# EAGLE design Quarfinder (EAGLE 9.0.1)

## Sheet 1 of 2
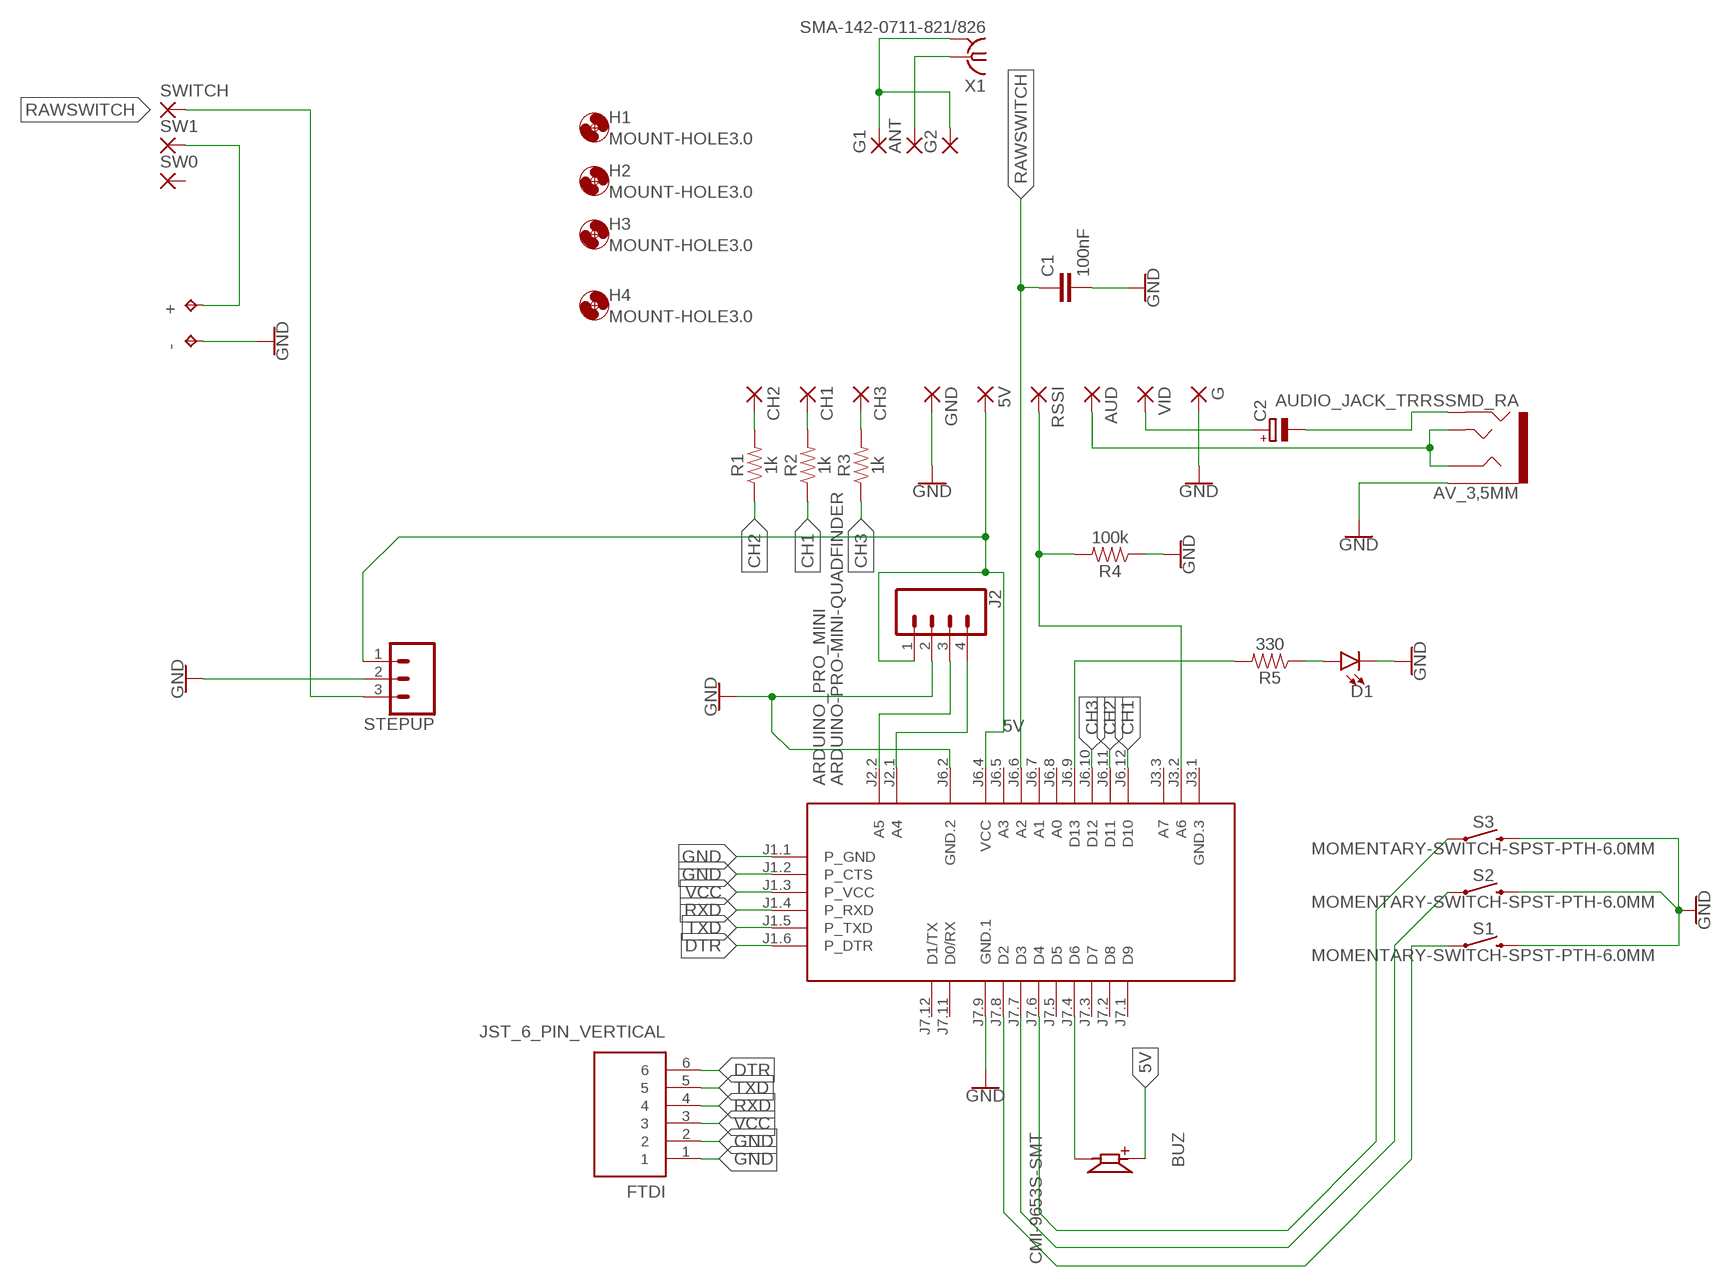
[diagram p0: schematic, sheet 1]

### Parts
5V  SMD2  [SMD1,27-2,54]
+  TPTP20R  [TP20R]
-  TPTP20R  [TP20R]
ANT  SMD2  [SMD1,27-2,54]
ARDUINO_PRO_MINI  ARDUINO-PRO-MINI-QUADFINDER  [ARDUINO-PRO-MINI]
AUD  SMD2  [SMD1,27-2,54]
AV_3,5MM  AUDIO_JACK_TRRSSMD_RA  [AUDIO_JACK_3.5MM_TRRS_SMD_RA]
BUZ  CMI-9653S-SMT  [CUI_CMI-9653S-SMT]
C1  100nF  1.0UF-0603-16V-10%  [0603]
C2  CPOL-EUD/7343-31R  [D/7343-31R]
CH1  SMD2  [SMD1,27-2,54]
CH2  SMD2  [SMD1,27-2,54]
CH3  SMD2  [SMD1,27-2,54]
D1  LED3MM  [LED_3MM]
FTDI  JST_6_PIN_VERTICAL  [JST-6-SMD-VERT-1.0MM]
G  SMD2  [SMD1,27-2,54]
G1  SMD2  [SMD1,27-2,54]
G2  SMD2  [SMD1,27-2,54]
GND  SMD2  [SMD1,27-2,54]
H1  MOUNT-HOLE3.0  [3,0]
H2  MOUNT-HOLE3.0  [3,0]
H3  MOUNT-HOLE3.0  [3,0]
H4  MOUNT-HOLE3.0  [3,0]
J2  CONN_04  [1X04]
R1  1k  1KOHM-0603-1/10W-1%  [0603]
R2  1k  1KOHM-0603-1/10W-1%  [0603]
R3  1k  1KOHM-0603-1/10W-1%  [0603]
R4  100k  1KOHM-0603-1/10W-1%  [0603]
R5  330  1KOHM-0603-1/10W-1%  [0603]
RSSI  SMD2  [SMD1,27-2,54]
S1  MOMENTARY-SWITCH-SPST-PTH-6.0MM  [TACTILE_SWITCH_PTH_6.0MM]
S2  MOMENTARY-SWITCH-SPST-PTH-6.0MM  [TACTILE_SWITCH_PTH_6.0MM]
S3  MOMENTARY-SWITCH-SPST-PTH-6.0MM  [TACTILE_SWITCH_PTH_6.0MM]
STEPUP  CONN_03  [1X03]
SW0  SMD2  [SMD1,27-2,54]
SW1  SMD2  [SMD1,27-2,54]
SWITCH  SMD2  [SMD1,27-2,54]
VID  SMD2  [SMD1,27-2,54]
X1  SMA-142-0711-821/826  [J502-ND-142-0711-821/826]

### Nets
5V [power]: 5V.1(P) ARDUINO_PRO_MINI.J6.4(VCC) BUZ.P J2.1 STEPUP.1
CH1: ARDUINO_PRO_MINI.J6.12(D10) R2.1
CH2: ARDUINO_PRO_MINI.J6.11(D11) R1.1
CH3: ARDUINO_PRO_MINI.J6.10(D12) R3.1
DTR: ARDUINO_PRO_MINI.J1.6(P_DTR) FTDI.6
GND: -.TP ARDUINO_PRO_MINI.J1.1(P_GND) ARDUINO_PRO_MINI.J1.2(P_CTS) ARDUINO_PRO_MINI.J6.2(GND.2) ARDUINO_PRO_MINI.J7.9(GND.1) AV_3,5MM.EARTH C1.2 D1.K(C) FTDI.1 FTDI.2 G1.1(P) G2.1(P) G.1(P) GND.1(P) J2.2 R4.1 S1.3 S2.3 S3.3 STEPUP.2 X1.G@1 X1.G@2 X1.G@3 X1.G@4
N$1: ANT.1(P) X1.1
N$2: C2.+ VID.1(P)
N$3: CH2.1(P) R1.2
N$4: CH1.1(P) R2.2
N$5: CH3.1(P) R3.2
N$6: ARDUINO_PRO_MINI.J2.1(A4) J2.4
N$7: ARDUINO_PRO_MINI.J2.2(A5) J2.3
N$8: ARDUINO_PRO_MINI.J3.2(A6) R4.2 RSSI.1(P)
N$9: ARDUINO_PRO_MINI.J7.8(D2) S1.1
N$10: ARDUINO_PRO_MINI.J7.4(D6) BUZ.N
N$11: ARDUINO_PRO_MINI.J7.7(D3) S2.1
N$12: ARDUINO_PRO_MINI.J7.6(D4) S3.1
N$13: D1.A R5.1
N$14: ARDUINO_PRO_MINI.J6.9(D13) R5.2
N$16: AUD.1(P) AV_3,5MM.RING1 AV_3,5MM.TIP
N$18: AV_3,5MM.RING2 C2.-
RAWSWITCH [power]: ARDUINO_PRO_MINI.J6.6(A2) C1.1 STEPUP.3 SWITCH.1(P)
RXD: ARDUINO_PRO_MINI.J1.4(P_RXD) FTDI.4
TXD: ARDUINO_PRO_MINI.J1.5(P_TXD) FTDI.5
VCC: ARDUINO_PRO_MINI.J1.3(P_VCC) FTDI.3
VIN [power]: +.TP SW1.1(P)
Unconnected: ARDUINO_PRO_MINI.J3.1(GND.3) ARDUINO_PRO_MINI.J3.3(A7) ARDUINO_PRO_MINI.J6.5(A3) ARDUINO_PRO_MINI.J6.7(A1) ARDUINO_PRO_MINI.J6.8(A0) ARDUINO_PRO_MINI.J7.1(D9) ARDUINO_PRO_MINI.J7.2(D8) ARDUINO_PRO_MINI.J7.3(D7) ARDUINO_PRO_MINI.J7.5(D5) ARDUINO_PRO_MINI.J7.11(D0/RX) ARDUINO_PRO_MINI.J7.12(D1/TX) SW0.1(P)

## Sheet 2 of 2

## Library data of the parts
5V ANT AUD CH1-CH3 G G1 G2 GND RSSI SW0 SW1 SWITCH VID = wirepad:SMD2: SMD PAD
+ - = testpad:TP: Test pad
ARDUINO_PRO_MINI = diy-modules:ARDUINO-PRO-MINI-*: Arduino Pro Mini and compatible devices More details available here: https://www.arduino.cc/en/Main/ArduinoBoardProMini Click here to find device on ebay.com <http://www.ebay.com/sch/arduino+pro+mini>
AV_3,5MM = SparkFun-Connectors:AUDIO_JACK_TRRS: Audio Jack - 3.5mm TRRS (SMD) This is a 3.5mm TRRS SMD audio jack. TRRS connectors are the audio-style connectors that you see on some phones, MP3 players and development boards. TRRS stands for “tip, ring, ring, sleeve,” which reflects that this has three conductors and a ground. SparkFun Products: Audio Jack <https://www.sparkfun.com/products/12639> mbed Starter Kit <https://www.sparkfun.com/products/12968> SparkFun TRRS 3.5mm Jack Breakout <https://www.sparkfun.com/products/11570>; PROD_ID: CONN-10676; SF_ID: PRT-12639
BUZ = CMI-9653S-SMT:CMI-9653S-SMT: 9.6 mm, 3 Vdc, 80 dB, 2.7 kHz, Surface Mount (SMT), Driving Circuit, Magnetic Audio Indicator Buzzer; AVAILABILITY: Unavailable; CUI_PURCHASE_URL: https://www.cui.com/product/audio/buzzers/audio-indicators/magnetic/cmi-9653s-smt?utm_source=snapeda.com&utm_medium=referral&utm_campaign=snapedaBOM; DESCRIPTION: CMI Series Square 9.6 x 5 mm 2.7 kHz 3 V 80 dBA SMT Magnetic Buzzer Indicator; MF: CUI Inc.; MP: CMI-9653S-SMT-TR; PACKAGE: SIP-5 CUI; PRICE: None
C1 = SparkFun-Capacitors:1.0UF: 1µF ceramic capacitors A capacitor is a passive two-terminal electrical component used to store electrical energy temporarily in an electric field.; PROD_ID: CAP-00868; VALUE: 1.0uF
C2 = rcl:CPOL-EU: POLARIZED CAPACITOR, European symbol; SPICEPREFIX: C
D1 = SparkFun-LED:LED: LED (Generic) Standard schematic elements and footprints for 5mm, 3mm, 1206, and 0603 sized LEDs. Generic LEDs with no color specified.; PROD_ID: DIO-08794
FTDI = SparkFun-Connectors:JST_6_PIN_VERTICAL: JST 6 pin vertical connector Here is a six pin vertical 1.0mm pitch connector. It is useful if you need something very tiny as a connection. These are not the standard JST type connectors we use on most of our boards, but are actually the much smaller JST-SH type. Here is the connector we sell at SparkFun: JST SH Vertical 6-Pin Connector - SMD <https://www.sparkfun.com/products/579> (GPS-00579) Datasheet <http://www.sparkfun.com/datasheets/GPS/EM406-SMDConnector-eSH.pdf> It was used on these SparkFun products: SparkFun GPS Breakout <https://www.sparkfun.com/products/11818> (BOB-11818) SparkFun Weather Shield <https://www.sparkfun.com/products/12081> (DEV-12081) And many, many other GPS related products.; PROD_ID: CONN-08249; SF_ID: GPS-00579
H1-H4 = holes:MOUNT-HOLE: MOUNTING HOLE with drill center marker
J2 = SparkFun-Connectors:CONN_04: Multi connection point. Often used as Generic Header-pin footprint for 0.1 inch spaced/style header connections On any of the 0.1 inch spaced packages, you can populate with these: Break Away Headers - Straight <https://www.sparkfun.com/products/116> (PRT-00116) Break Away Male Headers - Right Angle <https://www.sparkfun.com/products/553> (PRT-00553) Female Headers <https://www.sparkfun.com/products/115> (PRT-00115) Break Away Headers - Machine Pin <https://www.sparkfun.com/products/117> (PRT-00117) Break Away Female Headers - Swiss Machine Pin <https://www.sparkfun.com/products/743> (PRT-00743) For SCREWTERMINALS and SPRING TERMINALS visit here: Screw Terimnals on SparkFun.com <https://www.sparkfun.com/search/results?term=Screw+Terminals> (5mm/3.5mm/2.54mm spacing) This device is also useful as a general connection point to wire up your design to another part of your project. Our various solder wires solder well into these plated through hole pads. Hook-Up Wire - Assortment (Stranded, 22 AWG) <https://www.sparkfun.com/products/11375> (PRT-11375) Hook-Up Wire - Assortment (Solid Core, 22 AWG) <https://www.sparkfun.com/products/11367> (PRT-11367) View the entire wire category on our website here <https://www.sparkfun.com/categories/141> Special notes: Molex polarized connector foot print use with SKU : PRT-08231 with associated crimp pins and housings. 1MM SMD Version SKU: PRT-10208; PROD_ID: CONN-09696
R1-R3 = SparkFun-Resistors:1KOHM: 1kΩ resistor A resistor is a passive two-terminal electrical component that implements electrical resistance as a circuit element. Resistors act to reduce current flow, and, at the same time, act to lower voltage levels within circuits. - Wikipedia; PROD_ID: RES-07856
R4 R5 = SparkFun-Resistors:1KOHM: 1kΩ resistor A resistor is a passive two-terminal electrical component that implements electrical resistance as a circuit element. Resistors act to reduce current flow, and, at the same time, act to lower voltage levels within circuits. - Wikipedia; PROD_ID: RES-07856; VALUE: 1k
S1-S3 = SparkFun-Switches:MOMENTARY-SWITCH-SPST: Momentary Switch (Pushbutton) - SPST Normally-open (NO) SPST momentary switches (buttons, pushbuttons). Variants PTH-12MM - 12mm square, through-hole Momentary Pushbutton Switch - 12mm Square <https://www.sparkfun.com/products/9190> (COM-09190) PTH-6.0MM, PTH-6.0MM-KIT - 6.0mm square, through-hole Mini Pushbutton Switch <https://www.sparkfun.com/products/97> (COM-00097) KIT package intended for soldering kit's - only one side of pads' copper is exposed. PTH-RIGHT-ANGLE-KIT - Right-angle, through-hole Right Angle Tactile Button <https://www.sparkfun.com/products/10791> - Used on SparkFun BigTime Watch Kit <https://www.sparkfun.com/products/11734> SMD-12MM - 12mm square, surface-mount Tactile Button - SMD (12mm) <https://www.sparkfun.com/products/12993> (COM-12993) Used on SparkFun PicoBoard <https://www.sparkfun.com/products/11888> SMD-4.5MM - 4.5mm Square Trackball Switch Used on SparkFun Blackberry Trackballer Breakout <https://www.sparkfun.com/products/13169> SMD-4.6MMX2.8MM - 4.60mm x 2.80mm, surface mount Used on SparkFun SAMD21 Mini Breakout <https://www.sparkfun.com/products/13664> SMD-5.2MM, SMD-5.2-REDUNDANT - 5.2mm square, surface-mount Mini Pushbutton Switch - SMD <https://www.sparkfun.com/products/8720> (COM-08720) Used on Arduino Pro Mini <https://www.sparkfun.com/products/11114> REDUNDANT package connects both switch circuits together SMD-6.0X3.5MM - 6.0 x 3.5mm, surface mount Momentary Reset Switch SMD <https://www.sparkfun.com/products/8229> (COM-08229) SMD-6.2MM-TALL - 6.2mm square, surface mount Tactile Button - SMD (6mm) <https://www.sparkfun.com/products/12992> Used on SparkFun Digital Sandbox <https://www.sparkfun.com/products/12651> SMD-RIGHT-ANGLE - Right-angle, surface mount Used on SparkFun Block for Intel® Edison - Arduino <https://www.sparkfun.com/products/13036>; PROD_ID: SWCH-08441; SF_SKU: COM-00097
STEPUP = SparkFun-Connectors:CONN_03: Multi connection point. Often used as Generic Header-pin footprint for 0.1 inch spaced/style header connections On any of the 0.1 inch spaced packages, you can populate with these: Break Away Headers - Straight <https://www.sparkfun.com/products/116> (PRT-00116) Break Away Male Headers - Right Angle <https://www.sparkfun.com/products/553> (PRT-00553) Female Headers <https://www.sparkfun.com/products/115> (PRT-00115) Break Away Headers - Machine Pin <https://www.sparkfun.com/products/117> (PRT-00117) Break Away Female Headers - Swiss Machine Pin <https://www.sparkfun.com/products/743> (PRT-00743) Stackable Header - 3 Pin (Female, 0.1") <https://www.sparkfun.com/products/13875> (PRT-13875) For SCREWTERMINALS and SPRING TERMINALS visit here: Screw Terimnals on SparkFun.com <https://www.sparkfun.com/search/results?term=Screw+Terminals> (5mm/3.5mm/2.54mm spacing) This device is also useful as a general connection point to wire up your design to another part of your project. Our various solder wires solder well into these plated through hole pads. Hook-Up Wire - Assortment (Stranded, 22 AWG) <https://www.sparkfun.com/products/11375> (PRT-11375) Hook-Up Wire - Assortment (Solid Core, 22 AWG) <https://www.sparkfun.com/products/11367> (PRT-11367) View the entire wire category on our website here <https://www.sparkfun.com/categories/141> Special notes: Molex polarized connector foot print use with SKU : PRT-08232 with associated crimp pins and housings.
X1 = con-coax:SMA-: SMA 50 Ohm End Launch Jack Receptacle - Round Contact Johnson Components Source: www.johnsoncomponents.com .. J502-ND.pdf; MF: JOHNSON COMPONENTS; MPN: 142-0711-821; OC_FARNELL: 1019328; OC_NEWARK: 16F3627

## Net classes
0 default: width 0.254 mm, drill 0.303 mm, clearance 0.303 mm
1 power: width 0.406 mm, drill 0.406 mm, clearance 0.406 mm

## Board
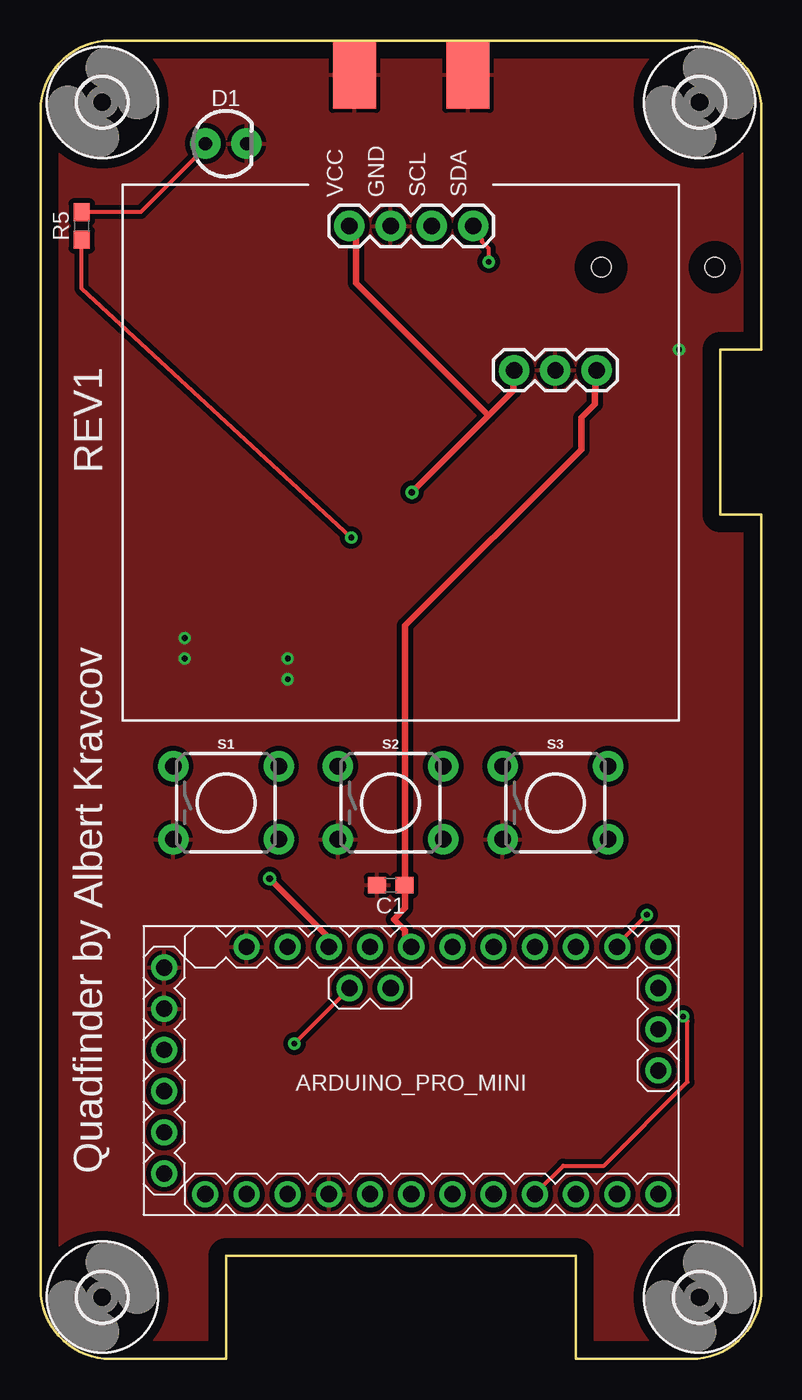
[diagram p1: board, top side]
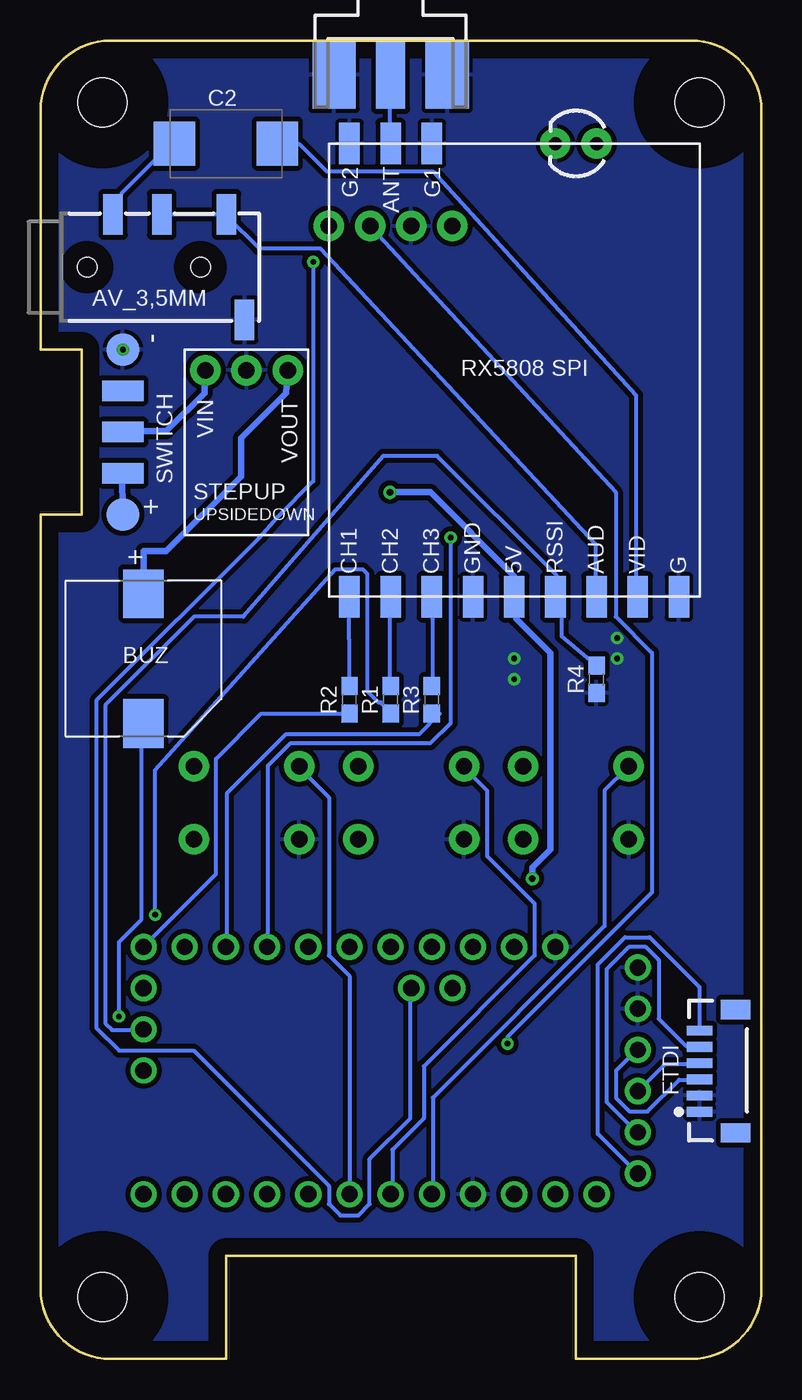
[diagram p2: board, bottom side, seen from below]

Size 44.45 x 81.28 mm. Coordinates in mm from the lower left corner, seen from the top.
Outline: 0,4.34 0,76.94 arc-90 4.34,81.28 40.11,81.28 arc-90 44.45,76.94 44.45,62.23 41.91,62.23 41.91,52.07 44.45,52.07 44.45,4.34 arc-90 40.11,0 33.02,0 33.02,6.35 11.43,6.35 11.43,0 4.34,0 arc-90 0,4.34
Copper layers (1*16): Top 0.035mm / dielectric 1.5mm / Bottom 0.035mm
Design rules "default *": minimum track width 6mil, minimum drill 0.35mm, track to track 6mil, track to pad 6mil, pad to pad 6mil, via to via 6mil, smd to smd 6mil, copper to edge 40mil, drill to drill 6mil, minimum pad ring 12mil, minimum via ring 8mil, stop-mask expansion 4mil, vias tented up to drill 2mm, thermal gap 10mil

### Footprints (pad centres in the part's own frame; a part is rotated, then mirrored left to right if it is on the bottom)
SMD1,27-2,54 = smd 1.27 x 2.54: 1 0,0
TP20R = smd 2 x 2: TP 0,0
ARDUINO-PRO-MINI = drill 1: J1.1 -15.24,6.35; J1.2 -15.24,3.81; J1.3 -15.24,1.27; J1.4 -15.24,-1.27; J1.5 -15.24,-3.81; J1.6 -15.24,-6.35; J2.1 -1.27,5.08; J2.2 -3.81,5.08; J3.1 15.24,0; J3.2 15.24,2.54; J3.3 15.24,5.08; J6.2 -10.16,7.62; J6.3 -7.62,7.62; J6.4 -5.08,7.62; J6.5 -2.54,7.62; J6.6 0,7.62; J6.7 2.54,7.62; J6.8 5.08,7.62; J6.9 7.62,7.62; J6.10 10.16,7.62; J6.11 12.7,7.62; J6.12 15.24,7.62; J7.1 15.24,-7.62; J7.2 12.7,-7.62; J7.3 10.16,-7.62; J7.4 7.62,-7.62; J7.5 5.08,-7.62; J7.6 2.54,-7.62; J7.7 0,-7.62; J7.8 -2.54,-7.62; J7.9 -5.08,-7.62; J7.10 -7.62,-7.62; J7.11 -10.16,-7.62; J7.12 -12.7,-7.62
AUDIO_JACK_3.5MM_TRRS_SMD_RA = smd 1.2 x 2.5: EARTH 11.3,-3.25; RING1 6.2,3.25; RING2 3.2,3.25; TIP 10.2,3.25 | hole 1.2: 1.6,0; 8.6,0
CUI_CMI-9653S-SMT = smd 3 x 2.5: N -4,0; P 4,0
0603 = smd 1.1 x 1: 1 -0.85,0; 2 0.85,0
D/7343-31R = smd 2.55 x 2.7: + 3.175,0; - -3.175,0
LED_3MM = drill 0.813 pad 1.88: A -1.27,0; K 1.27,0
JST-6-SMD-VERT-1.0MM = smd 0.6 x 1.55: 1 -2.54,1.27; 2 -1.54,1.27; 3 -0.54,1.27; 4 0.46,1.27; 5 1.46,1.27; 6 2.46,1.27 | smd 1.2 x 1.8: P$1 -3.84,-0.955; P$2 3.76,-0.955
3,0 = hole 3: 0,0
1X04 = drill 1.016 pad 1.88: 1 0,0; 2 2.54,0; 3 5.08,0; 4 7.62,0
TACTILE_SWITCH_PTH_6.0MM = drill 1.016 pad 1.88: 1 -3.251,2.261; 2 3.251,2.261; 3 -3.251,-2.261; 4 3.251,-2.261
1X03 = drill 1.016 pad 1.88: 1 0,0; 2 2.54,0; 3 5.08,0
J502-ND-142-0711-821/826 = smd 4.191 x 1.778: 1 2.115,0 | smd 4.191 x 2.667: G@1 2.115,3.495; G@2 2.115,-3.495 | smd 4.191 x 2.667 bottom: G@3 2.115,3.495; G@4 2.115,-3.495

### Placement (x,y rotation side)
5V  15.24,46.99 0 bottom
+  39.37,52.07 270 bottom
-  39.37,62.23 270 bottom
ANT  22.86,74.93 0 bottom
ARDUINO_PRO_MINI  22.86,17.78 0 top
AUD  10.16,46.99 0 bottom
AV_3,5MM  43.18,67.31 0 bottom
BUZ  38.1,43.18 90 bottom
C1  21.59,29.21 180 top
C2  33.02,74.93 0 bottom
CH1  25.4,46.99 0 bottom
CH2  22.86,46.99 0 bottom
CH3  20.32,46.99 0 bottom
D1  11.43,74.93 0 top
FTDI  2.54,17.78 90 bottom
G  5.08,46.99 0 bottom
G1  20.32,74.93 0 bottom
G2  25.4,74.93 0 bottom
GND  17.78,46.99 0 bottom
H1  3.81,3.81 0 top
H2  3.81,77.47 0 top
H3  40.64,3.81 0 top
H4  40.64,77.47 0 top
J2  19.05,69.85 0 top
R1  22.86,40.64 90 bottom
R2  25.4,40.64 90 bottom
R3  20.32,40.64 90 bottom
R4  10.16,41.91 90 bottom
R5  2.54,69.85 270 top
RSSI  12.7,46.99 0 bottom
S1  11.43,34.29 0 top
S2  21.59,34.29 0 top
S3  31.75,34.29 0 top
STEPUP  29.21,60.96 0 top
SW0  39.37,59.69 90 bottom
SW1  39.37,54.61 90 bottom
SWITCH  39.37,57.15 90 bottom
VID  7.62,46.99 0 bottom
X1  22.86,81.28 270 bottom

### Tracks (layer width: path | path; a pad name or v marks a point on that pad's centre or on a via)
5V  (via drill 0.41)
  Top 0.406: 27.64,58.17 29.17,59.7 STEPUP.1 | 27.64,58.17 v22.9,53.43 | v14.12,29.61 17.75,25.99 17.75,25.43 ARDUINO_PRO_MINI.J6.4 | 27.64,58.17 27.08,58.72 19.46,66.31 19.46,69.17 19.14,69.73 J2.1
  Bottom 0.406: v22.9,53.43 20.41,53.43 15.25,48.28 15.25,47.02 5V.1 15.11,45.61 13.01,43.51 13.01,31.42 14.12,30.31 v14.12,29.61 | BUZ.P 38.08,49.81 36.69,49.81 32.09,54.41 32.09,56.77 29.31,59.56 STEPUP.1
CH1
  Bottom 0.254: R2.1 25.42,39.78 30.84,39.78 33.63,36.99 33.63,29.89 38.08,25.43 ARDUINO_PRO_MINI.J6.12
CH2  (via drill 0.35)
  Top 0.254: v37.39,27.38 35.44,25.43 ARDUINO_PRO_MINI.J6.11
  Bottom 0.254: v37.39,27.38 37.39,36.3 26.26,48.69 24.59,48.69 24.31,48.42 24.31,41.17 23.61,40.48 23.47,40.48 22.92,39.92 R1.1
CH3
  Bottom 0.254: R3.1 20.41,39.78 19.83,39.78 21.09,38.52 29.31,38.52 32.93,34.9 32.93,25.43 ARDUINO_PRO_MINI.J6.10
DTR
  Bottom 0.254: FTDI.6 3.82,20.28 3.82,22.92 6.88,25.99 8.41,25.99 10.08,24.32 10.08,13.87 7.72,11.5 ARDUINO_PRO_MINI.J1.6
GND  (via drill 0.35)
  other vias: 39.37,62.23 8.89,44.45 8.89,43.18 15.24,43.18 15.24,41.91
  pour Top: -2.54,85.09 48.26,85.09 48.26,83.82 48.26,-11.43 46.99,-11.43 -3.81,-11.43 -3.81,85.09
  pour Bottom: -5.08,86.36 -5.08,-12.7 -3.81,-12.7 49.53,-12.7 49.53,86.36
N$1
  Bottom 0.254: ANT.1 22.92,76.29 22.92,79.06 X1.1
N$2
  Bottom 0.254: VID.1 7.73,47.02 7.73,59.42 20.25,73.21 26.8,73.21 28.47,74.88 C2.+
N$3
  Bottom 0.254: R1.2 22.92,41.59 22.92,46.88 CH2.1
N$4
  Bottom 0.254: R2.2 25.42,41.59 25.42,44.34 CH1.1
N$5
  Bottom 0.254: R3.2 20.27,41.59 20.27,45.61 CH3.1
N$6  (via drill 0.35)
  Top 0.254: v27.64,67.64 27.64,68.47 27.22,68.89 27.22,69.03 26.8,69.45 26.8,69.73 J2.4
  Bottom 0.254: v27.64,67.64 27.64,54.11 29.86,51.88 30.98,50.61 41.01,40.58 41.01,20.42 39.62,19.02 35.02,19.02 26.66,10.66 26.66,9.55 25.96,8.85 24.85,8.85 24.15,9.55 24.15,12.34 21.65,14.84 21.65,22.78 ARDUINO_PRO_MINI.J2.1
N$7  (via drill 0.35)
  Top 0.254: v15.66,19.44 19,22.78 ARDUINO_PRO_MINI.J2.2
  Bottom 0.254: v15.66,19.44 15.66,19.86 6.74,28.77 6.74,43.52 8.99,45.77 8.99,53.43 24.01,69.73 J2.3
N$8
  Bottom 0.254: R4.2 12.33,44.56 12.33,46.61 12.61,46.88 RSSI.1 12.61,48.29 19.99,55.68 23.32,55.68 31.95,45.77 34.99,45.77 40.45,40.3 40.45,20.7 40.03,20.28 38.22,20.28 ARDUINO_PRO_MINI.J3.2
N$9
  Bottom 0.254: ARDUINO_PRO_MINI.J7.8 20.25,10.25 20.25,16.1 9.67,26.69 9.67,35.04 8.27,36.44 S1.1
N$10  (via drill 0.35)
  Top 0.254: v39.62,21.11 39.89,20.83 39.89,17.07 34.74,11.92 32.23,11.92 30.56,10.25 ARDUINO_PRO_MINI.J7.4
  Bottom 0.254: v39.62,21.11 39.62,25.71 38.22,27.1 38.22,39.05 BUZ.N
N$11
  Bottom 0.254: ARDUINO_PRO_MINI.J7.7 22.76,10.25 22.76,12.89 20.81,14.84 20.81,18.05 13.98,24.87 13.98,28.08 16.91,31 16.91,35.04 18.3,36.44 S2.1
N$12
  Bottom 0.254: ARDUINO_PRO_MINI.J7.6 25.41,10.25 25.41,23.62 26.66,24.87 26.66,34.62 28.47,36.44 S3.1
N$13
  Top 0.254: R5.1 5.21,70.7 6.18,70.7 10.08,74.6 10.08,74.88 D1.A
N$14  (via drill 0.35)
  Top 0.254: v19.15,50.64 2.53,66 2.53,68.89 R5.2
  Bottom 0.254: v19.15,50.64 19.15,39.22 20.41,37.97 29.03,37.97 30.42,36.58 30.42,25.43 ARDUINO_PRO_MINI.J6.9
N$16
  Bottom 0.254: AV_3,5MM.RING1 33.07,70.56 AV_3,5MM.TIP 32.93,70.42 30.98,68.47 27.22,68.47 10.24,50.23 10.24,47.02 AUD.1
N$18
  Bottom 0.254: AV_3,5MM.RING2 39.89,70.56 39.48,71.83 36.29,75.02 C2.-
RAWSWITCH
  Top 0.406: ARDUINO_PRO_MINI.J6.6 22.76,25.43 22.76,25.85 22.48,26.13 22.48,26.41 21.79,27.1 22.48,27.8 22.48,29.19 C1.1 22.48,29.33 22.48,45.21 33.35,56.08 33.35,58.03 34.18,58.86 34.18,59.56 STEPUP.3
  Bottom 0.406: SWITCH.1 39.34,57.19 36.69,57.19 34.32,59.56 STEPUP.3
RXD
  Bottom 0.254: FTDI.4 3.82,18.19 5.9,18.19 7.58,16.52 ARDUINO_PRO_MINI.J1.4
TXD
  Bottom 0.254: FTDI.5 3.82,19.3 4.65,19.3 6.32,20.97 6.32,24.6 7.16,25.43 8.13,25.43 9.53,24.04 9.53,15.82 7.72,14.01 ARDUINO_PRO_MINI.J1.5
VCC
  Bottom 0.254: FTDI.3 3.82,17.21 5.07,17.21 7.02,15.26 8.13,15.26 8.97,16.1 8.97,17.77 7.72,19.02 ARDUINO_PRO_MINI.J1.3
VIN
  Bottom 0.406: +.TP 39.4,54.68 39.34,54.68 SW1.1

### Text on the board
tNames: VCC | GND | SCL | SDA | REV1 | Quadfinder by Albert Kravcov
bNames: RX5808 SPI | VOUT | VIN | STEPUP | UPSIDEDOWN